# Altium schematic sheet Sheet1.SchDoc
size A3
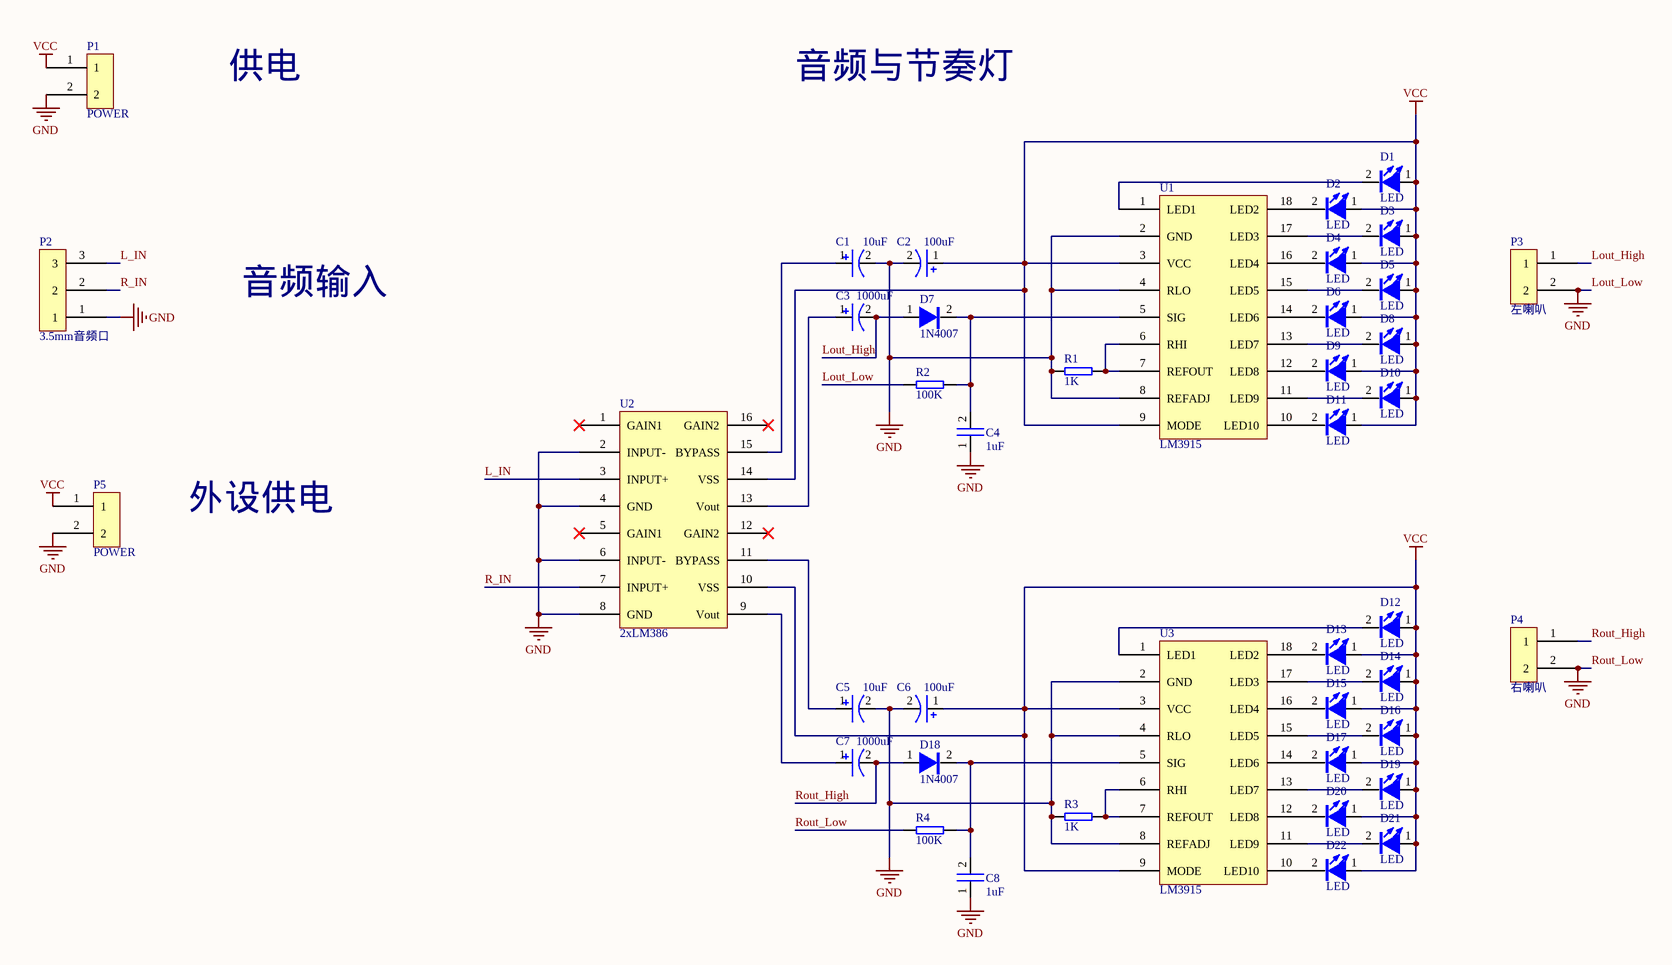
[diagram p0: Sheet1.SchDoc]

## Parts
C1  10uF  [极性电容_2.54mm直插 - duplicate]
C2  100uF  [极性电容_2.54mm直插 - duplicate]
C3  1000uF  [极性电容_2.54mm直插 - duplicate]
C4  1uF  [电容104]
C5  10uF  [极性电容_2.54mm直插 - duplicate]
C6  100uF  [极性电容_2.54mm直插 - duplicate]
C7  1000uF  [极性电容_2.54mm直插 - duplicate]
C8  1uF  [电容104]
D1  LED  [LED]
D2  LED  [LED]
D3  LED  [LED]
D4  LED  [LED]
D5  LED  [LED]
D6  LED  [LED]
D7  1N4007  [二极管1N4007]
D8  LED  [led]
D9  LED  [led]
D10  LED  [led]
D11  LED  [led]
D12  LED  [LED]
D13  LED  [LED]
D14  LED  [LED]
D15  LED  [LED]
D16  LED  [LED]
D17  LED  [LED]
D18  1N4007  [二极管1N4007]
D19  LED  [led]
D20  LED  [led]
D21  LED  [led]
D22  LED  [led]
P1  POWER  [2Pin_Type-C正]
P2  3.5mm音频口  [3.5耳机孔_小]
P3  左喇叭  [2pin插针]
P4  右喇叭  [2pin插针]
P5  POWER  [2pin插针]
R1  1K  [7.62mm直插]
R2  100K  [7.62mm直插]
R3  1K  [7.62mm直插]
R4  100K  [7.62mm直插]
U1  LM3915  [9Pin插座_18]
U2  2xLM386  [2xLM386]
U3  LM3915  [9Pin插座_18]

## Nets
Lout_Low: C1.2(-) C2.2(-) C4.1 C5.2(-) C6.2(-) C8.1 P1.2 P2.1 P3.2 P4.2 P5.2 R1.1 R2.1 R3.1 R4.1 U1.2(GND) U1.4(RLO) U1.8(REFADJ) U2.2(INPUT-) U2.4(GND) U2.6(INPUT-) U2.8(GND) U3.2(GND) U3.4(RLO) U3.8(REFADJ)  [also labelled GND, Rout_Low]
VCC: C2.1(+) C6.1(+) D1.1 D2.1 D3.1 D4.1 D5.1 D6.1 D8.1 D9.1 D10.1 D11.1 D12.1 D13.1 D14.1 D15.1 D16.1 D17.1 D19.1 D20.1 D21.1 D22.1 P1.1 P5.1 U1.3(VCC) U1.9(MODE) U2.10(VSS) U2.14(VSS) U3.3(VCC) U3.9(MODE)
L_IN: P2.3 U2.3(INPUT+)
Lout_High: C3.2(-) D7.1 P3.1
R_IN: P2.2 U2.7(INPUT+)
Rout_High: C7.2(-) D18.1 P4.1
NetC1_1: C1.1(+) U2.15(BYPASS)
NetC3_1: C3.1(+) U2.13(Vout)
NetC4_2: C4.2 D7.2 R2.2 U1.5(SIG)
NetC5_1: C5.1(+) U2.11(BYPASS)
NetC7_1: C7.1(+) U2.9(Vout)
NetC8_2: C8.2 D18.2 R4.2 U3.5(SIG)
NetD1_2: D1.2 U1.1(LED1)
NetD2_2: D2.2 U1.18(LED2)
NetD3_2: D3.2 U1.17(LED3)
NetD4_2: D4.2 U1.16(LED4)
NetD5_2: D5.2 U1.15(LED5)
NetD6_2: D6.2 U1.14(LED6)
NetD8_2: D8.2 U1.13(LED7)
NetD9_2: D9.2 U1.12(LED8)
NetD10_2: D10.2 U1.11(LED9)
NetD11_2: D11.2 U1.10(LED10)
NetD12_2: D12.2 U3.1(LED1)
NetD13_2: D13.2 U3.18(LED2)
NetD14_2: D14.2 U3.17(LED3)
NetD15_2: D15.2 U3.16(LED4)
NetD16_2: D16.2 U3.15(LED5)
NetD17_2: D17.2 U3.14(LED6)
NetD19_2: D19.2 U3.13(LED7)
NetD20_2: D20.2 U3.12(LED8)
NetD21_2: D21.2 U3.11(LED9)
NetD22_2: D22.2 U3.10(LED10)
NetR1_2: R1.2 U1.6(RHI) U1.7(REFOUT)
NetR3_2: R3.2 U3.6(RHI) U3.7(REFOUT)

Not connected (* = marked no-connect by the designer): U2 1(GAIN1)* 5(GAIN1)* 12(GAIN2)* 16(GAIN2)*

## Notes on the sheet
- 供电
- 音频与节奏灯
- 音频输入
- 外设供电

## Library data of the parts
C1-C3 C5-C7 = ECAP: 电容_极性
C4 C8 = CAP: 电容_普通
D1-D6 D8-D17 D19-D22 = LED: 二极管_发光
D7 D18 = DIO: 二极管_普通
P1 P3-P5 = PIN2: 2Pin插针
P2 = PIN3: 3Pin插针
R1-R4 = RES: 电阻
U1 U3 = LM3915: LED驱动IC
U2 = 2xLM386: 两个LM386